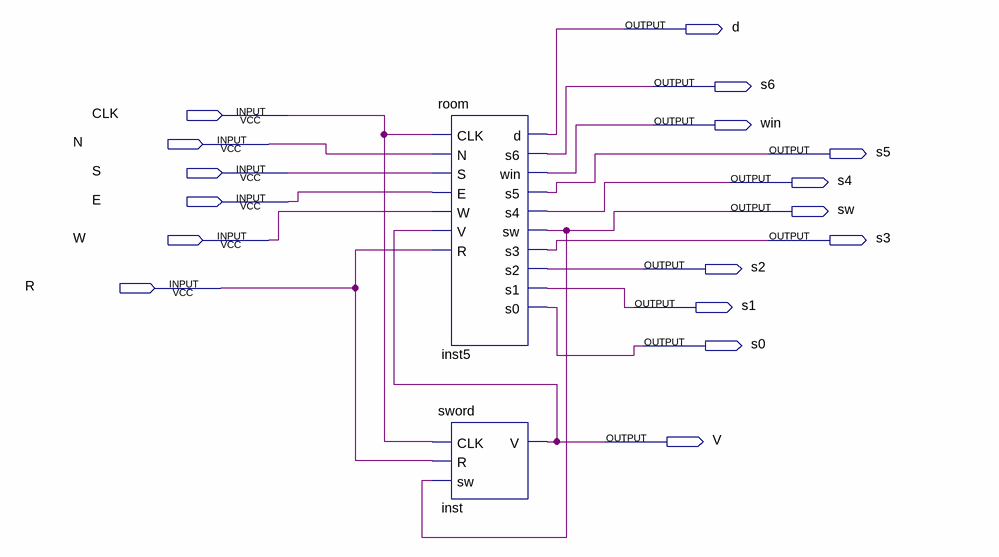
[diagram p0: schematic sheet]
// Quartus schematic Game.bdf as structural Verilog: 2 symbols, 17 pins
module Game (
  input  CLK,
  input  N,
  input  S,
  input  E,
  input  W,
  input  R,
  output d,
  output s6,
  output win,
  output s5,
  output s4,
  output sw,
  output s3,
  output s2,
  output s1,
  output s0,
  output V
);

  room inst5 (
    .CLK(CLK), .N(N), .S(S), .E(E), .W(W), .V(V), .R(R), .d(d), .s6(s6), .win(win), .s5(s5), .s4(s4),
    .sw(sw), .s3(s3), .s2(s2), .s1(s1), .s0(s0));
  sword inst (.CLK(CLK), .R(R), .sw(sw), .V(V));
endmodule
